# Altium project smart_mcu.PrjPcb
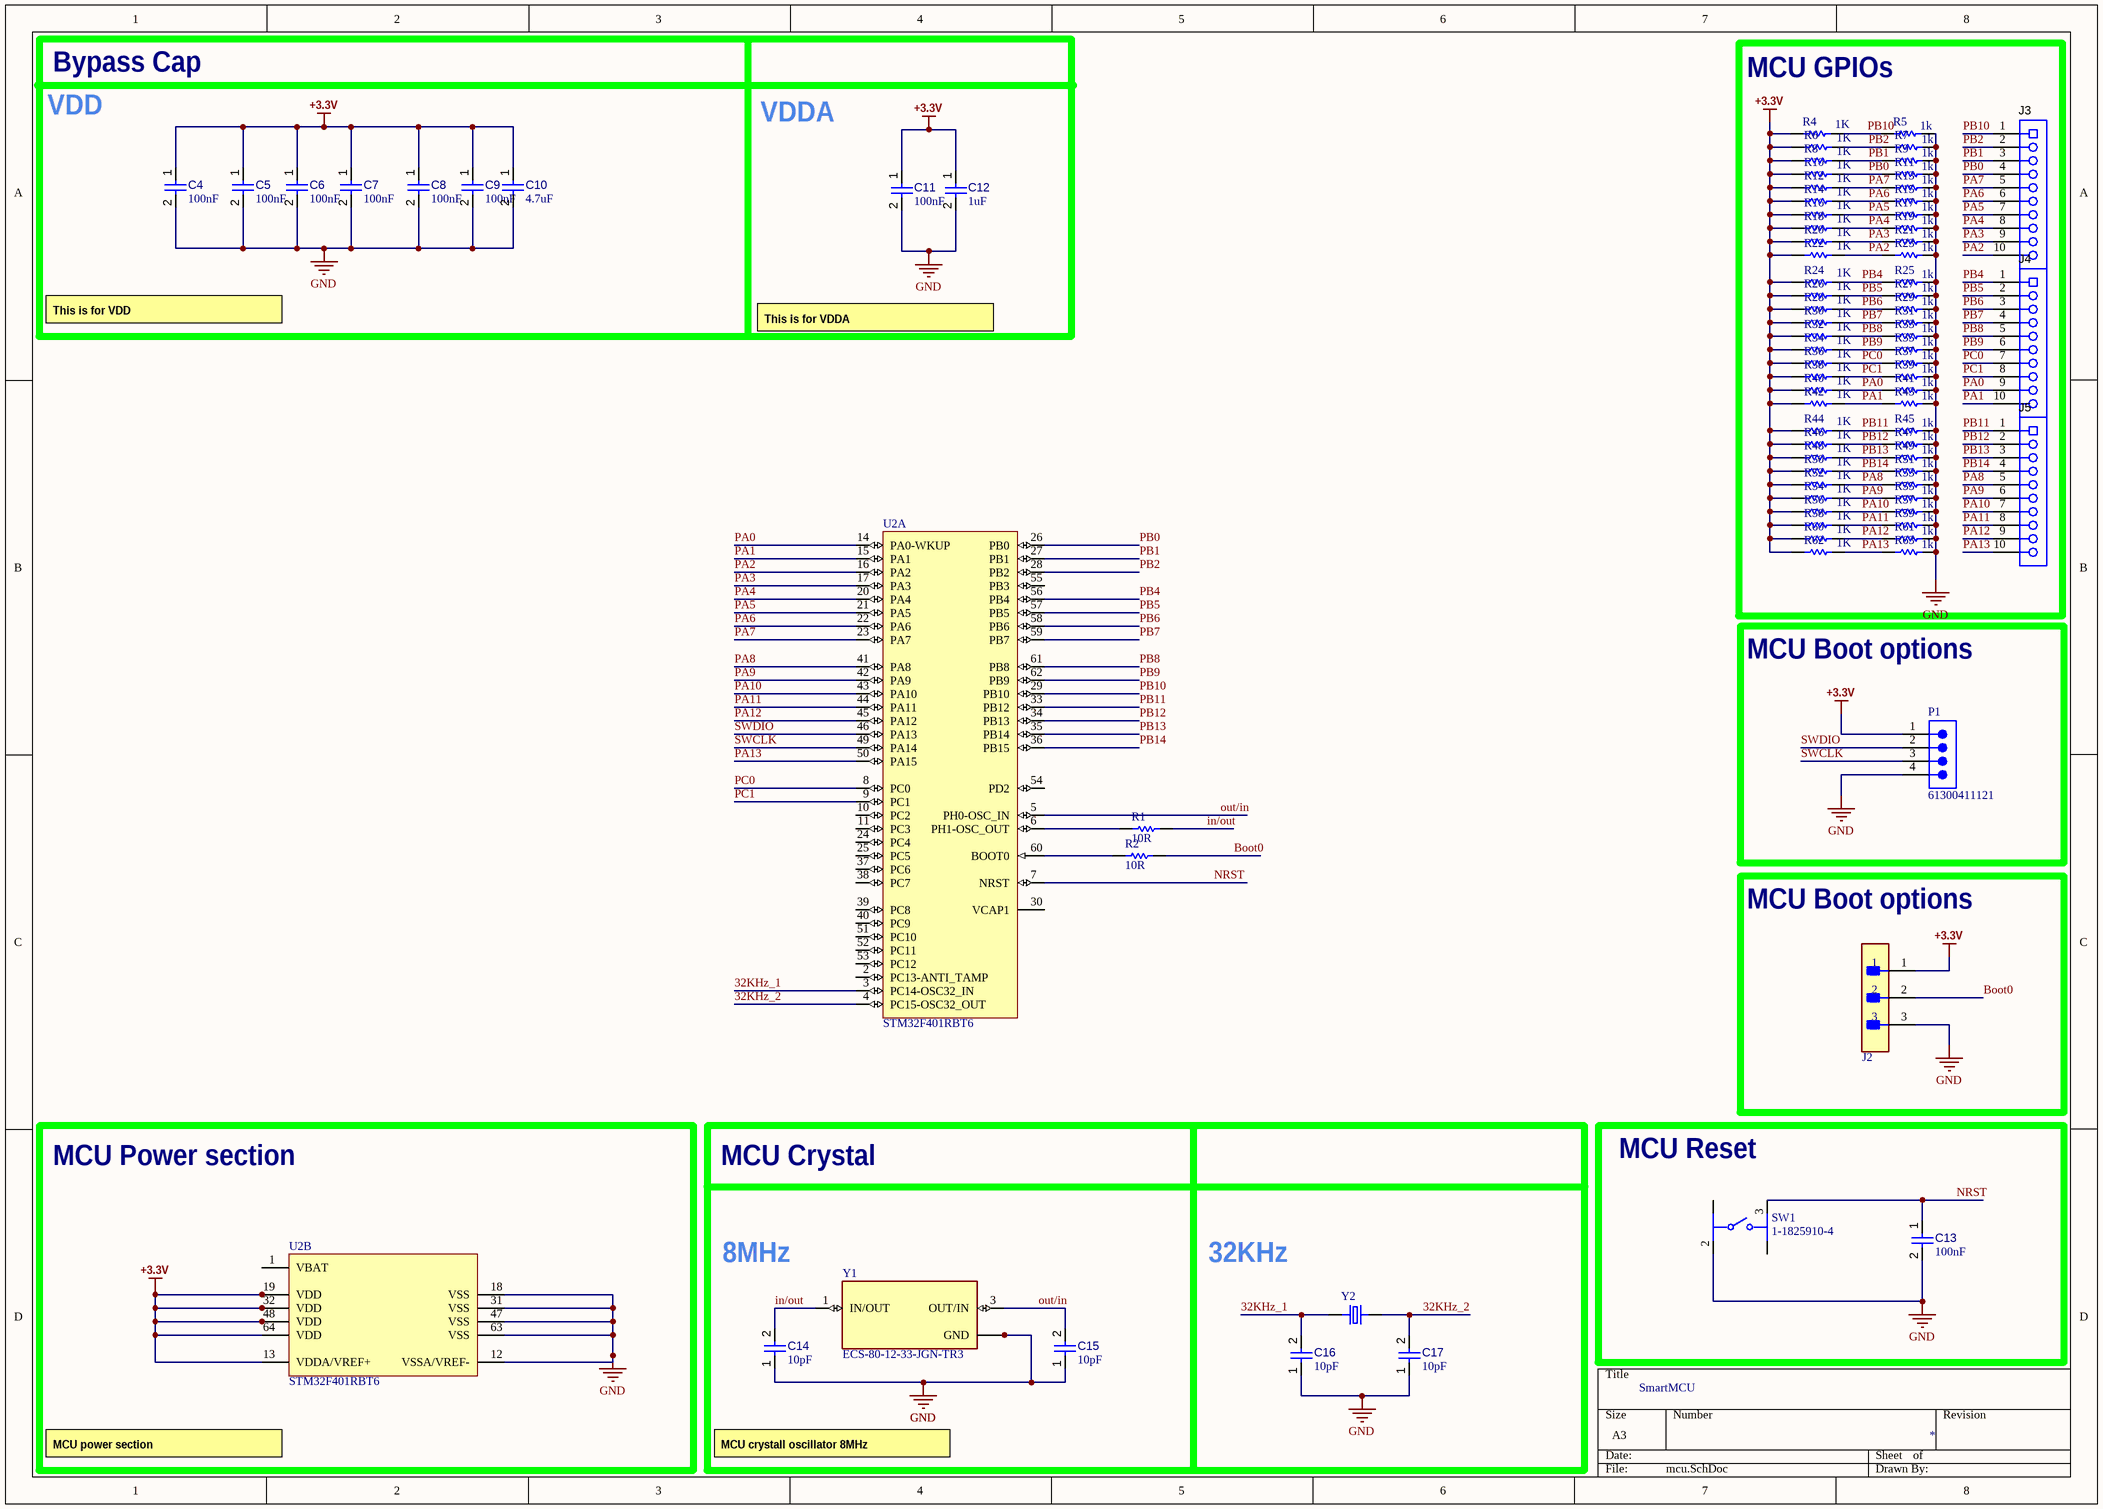
[diagram p0: mcu.SchDoc]
My Title: SmartMCU
3 sheets, 92 parts. Net scope: global (net labels, ports and power ports of the same name join across sheets).
Board file: smartMCUpcb.PcbDoc
Sheets:
  Sheetmain.SchDoc
  mcu.SchDoc
  powersupply.SchDoc

## Sheet Sheetmain.SchDoc
size A3; Author: Antony Austin; SheetNumber: 1; SheetTotal: 3

## Sheet mcu.SchDoc
size A3; SheetNumber: 2; SheetTotal: 3

### Parts
C4  value 100nF  [CAPC0603(1608)100_L]  (hidden comment: Capacitor 4.7µF +/-20% 10V 0603)
C5  value 100nF  [CAPC0603(1608)100_L]  (hidden comment: Capacitor 4.7µF +/-20% 10V 0603)
C6  value 100nF  [CAPC0603(1608)100_L]  (hidden comment: Capacitor 4.7µF +/-20% 10V 0603)
C7  value 100nF  [CAPC0603(1608)100_L]  (hidden comment: Capacitor 4.7µF +/-20% 10V 0603)
C8  value 100nF  [CAPC0603(1608)100_L]  (hidden comment: Capacitor 4.7µF +/-20% 10V 0603)
C9  value 100nF  [CAPC0603(1608)100_L]  (hidden comment: Capacitor 4.7µF +/-20% 10V 0603)
C10  value 4.7uF  [CAPC0603(1608)100_L]  (hidden comment: Capacitor 4.7µF +/-20% 10V 0603)
C11  value 100nF  [CAPC0603(1608)100_L]  (hidden comment: Capacitor 4.7µF +/-20% 10V 0603)
C12  value 1uF  [CAPC0603(1608)100_L]  (hidden comment: Capacitor 4.7µF +/-20% 10V 0603)
C13  value 100nF  [CAPC0603(1608)100_L]  (hidden comment: Capacitor 4.7µF +/-20% 10V 0603)
C14  value 10pF  [CAPC0402(1005)33_L]  (hidden comment: Capacitor 12pF +/-10% 50V 0402)
C15  value 10pF  [CAPC0402(1005)33_L]  (hidden comment: Capacitor 12pF +/-10% 50V 0402)
C16  value 10pF  [CAPC0402(1005)33_L]  (hidden comment: Capacitor 12pF +/-10% 50V 0402)
C17  value 10pF  [CAPC0402(1005)33_L]  (hidden comment: Capacitor 12pF +/-10% 50V 0402)
J2  951103-8622-AR  [FP-951103-8622-AR-MFG]  (value not drawn)
J3  5-534237-8  [TECO-5-534237-8_V]  (value not drawn)
J4  5-534237-8  [TECO-5-534237-8_V]  (value not drawn)
J5  5-534237-8  [TECO-5-534237-8_V]  (value not drawn)
P1  61300411121  [61300411121]
R1  value 10R  [RESC1608X55X25ML10T15]  (hidden comment: Resistor 0R +/- 5% 0603 100 mW)
R2  value 10R  [RESC1608X55X25ML10T15]  (hidden comment: Resistor 0R +/- 5% 0603 100 mW)
R4  value 1K  [RESC1608X55X25ML10T15]  (hidden comment: Resistor 0R +/- 5% 0603 100 mW)
R5  value 1k  [RESC1608X55X25ML10T15]  (hidden comment: Resistor 0R +/- 5% 0603 100 mW)
R6  value 1K  [RESC1608X55X25ML10T15]  (hidden comment: Resistor 0R +/- 5% 0603 100 mW)
R7  value 1k  [RESC1608X55X25ML10T15]  (hidden comment: Resistor 0R +/- 5% 0603 100 mW)
R8  value 1K  [RESC1608X55X25ML10T15]  (hidden comment: Resistor 0R +/- 5% 0603 100 mW)
R9  value 1k  [RESC1608X55X25ML10T15]  (hidden comment: Resistor 0R +/- 5% 0603 100 mW)
R10  value 1K  [RESC1608X55X25ML10T15]  (hidden comment: Resistor 0R +/- 5% 0603 100 mW)
R11  value 1k  [RESC1608X55X25ML10T15]  (hidden comment: Resistor 0R +/- 5% 0603 100 mW)
R12  value 1K  [RESC1608X55X25ML10T15]  (hidden comment: Resistor 0R +/- 5% 0603 100 mW)
R13  value 1k  [RESC1608X55X25ML10T15]  (hidden comment: Resistor 0R +/- 5% 0603 100 mW)
R14  value 1K  [RESC1608X55X25ML10T15]  (hidden comment: Resistor 0R +/- 5% 0603 100 mW)
R15  value 1k  [RESC1608X55X25ML10T15]  (hidden comment: Resistor 0R +/- 5% 0603 100 mW)
R16  value 1K  [RESC1608X55X25ML10T15]  (hidden comment: Resistor 0R +/- 5% 0603 100 mW)
R17  value 1k  [RESC1608X55X25ML10T15]  (hidden comment: Resistor 0R +/- 5% 0603 100 mW)
R18  value 1K  [RESC1608X55X25ML10T15]  (hidden comment: Resistor 0R +/- 5% 0603 100 mW)
R19  value 1k  [RESC1608X55X25ML10T15]  (hidden comment: Resistor 0R +/- 5% 0603 100 mW)
R20  value 1K  [RESC1608X55X25ML10T15]  (hidden comment: Resistor 0R +/- 5% 0603 100 mW)
R21  value 1k  [RESC1608X55X25ML10T15]  (hidden comment: Resistor 0R +/- 5% 0603 100 mW)
R22  value 1K  [RESC1608X55X25ML10T15]  (hidden comment: Resistor 0R +/- 5% 0603 100 mW)
R23  value 1k  [RESC1608X55X25ML10T15]  (hidden comment: Resistor 0R +/- 5% 0603 100 mW)
R24  value 1K  [RESC1608X55X25ML10T15]  (hidden comment: Resistor 0R +/- 5% 0603 100 mW)
R25  value 1k  [RESC1608X55X25ML10T15]  (hidden comment: Resistor 0R +/- 5% 0603 100 mW)
R26  value 1K  [RESC1608X55X25ML10T15]  (hidden comment: Resistor 0R +/- 5% 0603 100 mW)
R27  value 1k  [RESC1608X55X25ML10T15]  (hidden comment: Resistor 0R +/- 5% 0603 100 mW)
R28  value 1K  [RESC1608X55X25ML10T15]  (hidden comment: Resistor 0R +/- 5% 0603 100 mW)
R29  value 1k  [RESC1608X55X25ML10T15]  (hidden comment: Resistor 0R +/- 5% 0603 100 mW)
R30  value 1K  [RESC1608X55X25ML10T15]  (hidden comment: Resistor 0R +/- 5% 0603 100 mW)
R31  value 1k  [RESC1608X55X25ML10T15]  (hidden comment: Resistor 0R +/- 5% 0603 100 mW)
R32  value 1K  [RESC1608X55X25ML10T15]  (hidden comment: Resistor 0R +/- 5% 0603 100 mW)
R33  value 1k  [RESC1608X55X25ML10T15]  (hidden comment: Resistor 0R +/- 5% 0603 100 mW)
R34  value 1K  [RESC1608X55X25ML10T15]  (hidden comment: Resistor 0R +/- 5% 0603 100 mW)
R35  value 1k  [RESC1608X55X25ML10T15]  (hidden comment: Resistor 0R +/- 5% 0603 100 mW)
R36  value 1K  [RESC1608X55X25ML10T15]  (hidden comment: Resistor 0R +/- 5% 0603 100 mW)
R37  value 1k  [RESC1608X55X25ML10T15]  (hidden comment: Resistor 0R +/- 5% 0603 100 mW)
R38  value 1K  [RESC1608X55X25ML10T15]  (hidden comment: Resistor 0R +/- 5% 0603 100 mW)
R39  value 1k  [RESC1608X55X25ML10T15]  (hidden comment: Resistor 0R +/- 5% 0603 100 mW)
R40  value 1K  [RESC1608X55X25ML10T15]  (hidden comment: Resistor 0R +/- 5% 0603 100 mW)
R41  value 1k  [RESC1608X55X25ML10T15]  (hidden comment: Resistor 0R +/- 5% 0603 100 mW)
R42  value 1K  [RESC1608X55X25ML10T15]  (hidden comment: Resistor 0R +/- 5% 0603 100 mW)
R43  value 1k  [RESC1608X55X25ML10T15]  (hidden comment: Resistor 0R +/- 5% 0603 100 mW)
R44  value 1K  [RESC1608X55X25ML10T15]  (hidden comment: Resistor 0R +/- 5% 0603 100 mW)
R45  value 1k  [RESC1608X55X25ML10T15]  (hidden comment: Resistor 0R +/- 5% 0603 100 mW)
R46  value 1K  [RESC1608X55X25ML10T15]  (hidden comment: Resistor 0R +/- 5% 0603 100 mW)
R47  value 1k  [RESC1608X55X25ML10T15]  (hidden comment: Resistor 0R +/- 5% 0603 100 mW)
R48  value 1K  [RESC1608X55X25ML10T15]  (hidden comment: Resistor 0R +/- 5% 0603 100 mW)
R49  value 1k  [RESC1608X55X25ML10T15]  (hidden comment: Resistor 0R +/- 5% 0603 100 mW)
R50  value 1K  [RESC1608X55X25ML10T15]  (hidden comment: Resistor 0R +/- 5% 0603 100 mW)
R51  value 1k  [RESC1608X55X25ML10T15]  (hidden comment: Resistor 0R +/- 5% 0603 100 mW)
R52  value 1K  [RESC1608X55X25ML10T15]  (hidden comment: Resistor 0R +/- 5% 0603 100 mW)
R53  value 1k  [RESC1608X55X25ML10T15]  (hidden comment: Resistor 0R +/- 5% 0603 100 mW)
R54  value 1K  [RESC1608X55X25ML10T15]  (hidden comment: Resistor 0R +/- 5% 0603 100 mW)
R55  value 1k  [RESC1608X55X25ML10T15]  (hidden comment: Resistor 0R +/- 5% 0603 100 mW)
R56  value 1K  [RESC1608X55X25ML10T15]  (hidden comment: Resistor 0R +/- 5% 0603 100 mW)
R57  value 1k  [RESC1608X55X25ML10T15]  (hidden comment: Resistor 0R +/- 5% 0603 100 mW)
R58  value 1K  [RESC1608X55X25ML10T15]  (hidden comment: Resistor 0R +/- 5% 0603 100 mW)
R59  value 1k  [RESC1608X55X25ML10T15]  (hidden comment: Resistor 0R +/- 5% 0603 100 mW)
R60  value 1K  [RESC1608X55X25ML10T15]  (hidden comment: Resistor 0R +/- 5% 0603 100 mW)
R61  value 1k  [RESC1608X55X25ML10T15]  (hidden comment: Resistor 0R +/- 5% 0603 100 mW)
R62  value 1K  [RESC1608X55X25ML10T15]  (hidden comment: Resistor 0R +/- 5% 0603 100 mW)
R63  value 1k  [RESC1608X55X25ML10T15]  (hidden comment: Resistor 0R +/- 5% 0603 100 mW)
SW1  1-1825910-4  [FP-1-1825910-4-MFG]
U2  STM32F401RBT6  [STM-LQFP64_M]  (parts A,B of 2)
Y1  ECS-80-12-33-JGN-TR3  [XTAL_ECS-240-8-33-AGN-TR]
Y2  ECS-.320-12.5-13  [XTAL_ECS-.655-12.5-13X]  (value not drawn)

### Blocks framed on the sheet
MCU GPIOs: J3-J5 R4-R63
MCU Boot options: P1
MCU Boot options: J2
MCU Power section: U2
MCU Reset: C13 SW1

### Nets
+3.3V: C4.1 C5.1 C6.1 C7.1 C8.1 C9.1 C10.1 C11.1 C12.1 J2.1 P1.1 R4.1 R6.1 R8.1 R10.1 R12.1 R14.1 R16.1 R18.1 R20.1 R22.1 R24.1 R26.1 R28.1 R30.1 R32.1 R34.1 R36.1 R38.1 R40.1 R42.1 R44.1 R46.1 R48.1 R50.1 R52.1 R54.1 R56.1 R58.1 R60.1 R62.1 U2.13(VDDA/VREF+) U2.19(VDD) U2.32(VDD) U2.48(VDD) U2.64(VDD)
GND: C4.2 C5.2 C6.2 C7.2 C8.2 C9.2 C10.2 C11.2 C12.2 C13.2 C14.1 C15.1 C16.1 C17.1 J2.3 P1.4 R5.2 R7.2 R9.2 R11.2 R13.2 R15.2 R17.2 R19.2 R21.2 R23.2 R25.2 R27.2 R29.2 R31.2 R33.2 R35.2 R37.2 R39.2 R41.2 R43.2 R45.2 R47.2 R49.2 R51.2 R53.2 R55.2 R57.2 R59.2 R61.2 R63.2 SW1.2 U2.12(VSSA/VREF-) U2.18(VSS) U2.31(VSS) U2.47(VSS) U2.63(VSS) Y1.2(GND) Y1.4(GND)
32KHz_1: C16.2 U2.3(PC14-OSC32_IN) Y2.2
32KHz_2: C17.2 U2.4(PC15-OSC32_OUT) Y2.1
Boot0: J2.2 R2.2
in/out: C14.2 R1.2 Y1.1(IN/OUT)
NRST: C13.1 SW1.3 U2.7(NRST)
out/in: C15.2 U2.5(PH0-OSC_IN) Y1.3(OUT/IN)
PA0: J4.9 R40.2 R41.1 U2.14(PA0-WKUP)
PA1: J4.10 R42.2 R43.1 U2.15(PA1)
PA2: J3.10 R22.2 R23.1 U2.16(PA2)
PA3: J3.9 R20.2 R21.1 U2.17(PA3)
PA4: J3.8 R18.2 R19.1 U2.20(PA4)
PA5: J3.7 R16.2 R17.1 U2.21(PA5)
PA6: J3.6 R14.2 R15.1 U2.22(PA6)
PA7: J3.5 R12.2 R13.1 U2.23(PA7)
PA8: J5.5 R52.2 R53.1 U2.41(PA8)
PA9: J5.6 R54.2 R55.1 U2.42(PA9)
PA10: J5.7 R56.2 R57.1 U2.43(PA10)
PA11: J5.8 R58.2 R59.1 U2.44(PA11)
PA12: J5.9 R60.2 R61.1 U2.45(PA12)
PA13: J5.10 R62.2 R63.1 U2.50(PA15)
PB0: J3.4 R10.2 R11.1 U2.26(PB0)
PB1: J3.3 R8.2 R9.1 U2.27(PB1)
PB2: J3.2 R6.2 R7.1 U2.28(PB2)
PB4: J4.1 R24.2 R25.1 U2.56(PB4)
PB5: J4.2 R26.2 R27.1 U2.57(PB5)
PB6: J4.3 R28.2 R29.1 U2.58(PB6)
PB7: J4.4 R30.2 R31.1 U2.59(PB7)
PB8: J4.5 R32.2 R33.1 U2.61(PB8)
PB9: J4.6 R34.2 R35.1 U2.62(PB9)
PB10: J3.1 R4.2 R5.1 U2.29(PB10)
PB11: J5.1 R44.2 R45.1 U2.33(PB12)
PB12: J5.2 R46.2 R47.1 U2.34(PB13)
PB13: J5.3 R48.2 R49.1 U2.35(PB14)
PB14: J5.4 R50.2 R51.1 U2.36(PB15)
PC0: J4.7 R36.2 R37.1 U2.8(PC0)
PC1: J4.8 R38.2 R39.1 U2.9(PC1)
SWCLK: P1.3 U2.49(PA14)
SWDIO: P1.2 U2.46(PA13)
NetR1_1: R1.1 U2.6(PH1-OSC_OUT)
NetR2_1: R2.1 U2.60(BOOT0)

Not connected (* = marked no-connect by the designer): SW1 1 4; U2 1(VBAT) 2(PC13-ANTI_TAMP) 10(PC2) 11(PC3) 24(PC4) 25(PC5) 30(VCAP1) 37(PC6) 38(PC7) 39(PC8) 40(PC9) 51(PC10) 52(PC11) 53(PC12) 54(PD2) 55(PB3)

### Notes on the sheet
- Bypass Cap
- VDD
- VDDA
- This is for VDD
- This is for VDDA
- MCU Crystal
- 8MHz
- 32KHz
- MCU power section
- MCU crystall oscillator 8MHz

### Library data of the parts
C4-C13 = CMP-001-00076-4: Chip Capacitor, 4.7µF +/-20%, 10V, 0603, Thickness 1 mm; Tolerance: 10%; Mounting Technology: SMT; Case/Package: 0603; Pins: 2; Min Operating Temperature: -55°C; Max Operating Temperature: 85°C; Voltage Rating: 10V
C14-C17 = CMP-001-00072-4: Chip Capacitor, 12pF +/-10%, 50V, 0402, Thickness 0.33 mm; Tolerance: 20%; Pins: 2; Max Operating Temperature: 85°C; Case/Package: 0402; Voltage Rating: 50V; Mounting Technology: SMT; Min Operating Temperature: -55°C
J2 = CMP-05379-000003-1: CONN HEADER VERT 3POS 2MM; Manufacturer: 3M; Conn Gender: Male; Current Rating: 2A; Number Of Contacts: 3; Conn Orientation: Straight; Digikey Description: CONN HEADER VERT 3POS 2MM; Device Class L3: unset; Category: Conn; Height: 6.3mm; Manufacturer Part Number: 951103-8622-AR; RoHS: TRUE; Contact Material: Gold,Nickel; ComponentLink2Description: Datasheet; Temperature Range Low: -55°C; Device Class L1: Connectors; Pitch: 2mm; Mouser Description: Header; PinStrip; CopperAlloy; HighTempThermoplastic; 3Cnts; 1A; RtAngle; 951Series; Octopart: https://octopart.com/951103-8622-ar-3m-14400669; Package: 951103-8622-AR; Lead Free: Yes; Device Class L2: Headers and Wire Housings; Temperature Range High: +125°C; ComponentLink2URL: http://multimedia.3m.com/mws/media/1400506O/3m-pin-strip-header-951-series-78-5100-2653-3.pdf; Automotive: No; Temperature: -55°C to +125°C; Number Of Rows: 1
J3-J5 = CMP-002-00019-2: Female Receptacle, Pitch 2.54 mm, 1 x 10 Position, Height 8.64 mm, Tail Length 2.92 mm, -65 to 105 degC, RoHS, Tube; Manufacturer: TE Connectivity; Max Contact Resistance: 12mohm; Connector Type: Header; Current Rating: 2A; Voltage Rating: 750V; Rows: 1; Datasheet Version: Apr-13; Contact Plating: Gold; Min Operating Temperature: -65°C; Manufacturer URL: http://www.te.com/; Mounting Technology: TH; Contact Material: Bronze; RoHS Compliant: True; Packaging: Rail/Tube; Contact Finish: Gold; Pins: 10; Case/Package: 5-534237-8; Max Operating Temperature: 105°C; Lead Pitch: 2.54mm; Gender: Female; Package Quantity: 22; Colour: Black; Package Description: Female Receptacle, Pitch 2.54 mm, 1 x 10 Position, Height 8.64 mm, Tail Length 2.92 mm; Package Reference: 5-534237-8; Datasheet URL: http://www.te.com/commerce/DocumentDelivery/DDEController?Action=showdoc&DocId=Customer+Drawing%7F534237%7FR5%7Fpdf%7FEnglish%7FENG_CD_534237_R5.pdf%7F5-534237-8
P1 = CMP-1502-01064-3: NexarPartId: 32855522; Operating Supply Voltage: 250V; Pitch: 2.54mm; Contact Resistance: 20mΩ; Number of Positions: 4; Current Rating: 3A; Connector Type: Male Pin; Gender: Male; Contact Plating: Gold; Height: 8.89mm; Lead Pitch: 2.54mm; Lead Free: Lead Free; Contact Mating Length: 5.9944mm; Number of Rows: 1; Termination: Solder; Packaging: Bulk; REACH SVHC: Unknown; Min Operating Temperature: -40°C; RoHS: Compliant; Number of Contacts: 4; Voltage Rating: 250V; Color: Black; Max Operating Temperature: 105°C; Contact Material: Copper; Mount: Through Hole; Orientation: Vertical; Number of Pins: 4
R1 R2 R4-R63 = CMP-009-00006-5: Chip Resistor, 0 Ohm, 0.1 W, -55 to 155 degC, 0603 (1608 Metric); Power: 100mW; Voltage Rating: 50V; Max Operating Temperature: 155°C; RoHS Compliant: True; Mounting Technology: SM; Case/Package: 0603; Min Operating Temperature: -55°C; Tolerance: 5%; Pins: 2
SW1 = CMP-03407-000002-1: SWITCH TACTILE SPST-NO 0.05A 24V; Manufacturer: TE Connectivity; Operating Force: 160gf; Contact Current Rating: 50mA; Electromechanical Life: 100000Cycles; Contact Resistance: 100mΩ; Octopart: https://octopart.com/1-1825910-4-te+connectivity-42270468; ComponentLink2URL: https://www.te.com/commerce/DocumentDelivery/DDEController?Action=showdoc&DocId=Customer+Drawing%7F1825910%7FC10%7Fpdf%7FEnglish%7FENG_CD_1825910_C10.pdf%7F1-1825910-4; Throw Configuration: SPST-NO; Height: 9.8mm; Package: 1-1825910-4; Automotive: No; Device Class L2: Switches; Voltage Rating Dc: 24V; Temperature Range High: +85°C; Device Class L3: Tactile Switches; Mouser Description: Tactile Switches 6MM ACTHIGH TEMP TACT SWITCH; Manufacturer Part Number: 1-1825910-4; Lead Free: Yes; Temperature Range Low: -35°C; Digikey Description: SWITCH TACTILE SPST-NO 0.05A 24V; Device Class L1: Electromechanical; Mount: Through Hole; RoHS: TRUE; ComponentLink2Description: Datasheet; Temperature: -35°C to +85°C; Category: Switch
U2 = CMP-020-00012-3: ARM Cortex -M4 32b MCU+FPU, 256 KB Flash, 64 KB RAM, -40 to 85 degC, 64-Pin LQFP, RoHS, Tray; Manufacturer: STMicroelectronics; Frequency: 84MHz; Interface: USART; Power: 313mW; Max Supply Voltage: 3.6V; RAM Size: 64KB; I/Os: 50; Density: 128KB; Min Supply Voltage: 1.8V; Datasheet URL: http://www.st.com/st-web-ui/static/active/en/resource/technical/document/datasheet/DM00086815.pdf; Package Quantity: 160; Package Description: 64-Pin Low-profile Quad Flat Package, Body 10 x 10 mm, Pitch 0.5 mm; Packaging: Tray; Case/Package: LQFP; Pins: 64; Mounting Technology: SM; RoHS Compliant: True; Datasheet Version: Rev. 5, 08/2015; Manufacturer URL: http://www.st.com/; Package Reference: LQFP64
Y1 = ECS-80-12-33-JGN-TR3: Crystal 8MHz Â±20ppm (Tol) Â±30ppm (Stability) 12pF FUND 400Ohm 4-Pin Mini-CSMD T/R; MF: ECS Inc.; SnapEDA_Link: https://www.snapeda.com/parts/ECS-80-12-33-JGN-TR3/ECS/view-part/?ref=snap; Package: ECX-32-33-4 ECS; Value: *; MP: ECS-80-12-33-JGN-TR3; Check_prices: https://www.snapeda.com/parts/ECS-80-12-33-JGN-TR3/ECS/view-part/?ref=eda
Y2 = ECS-.320-12.5-13: Crystal  Cylindrical Can, Radial; Package: None; Price: None; Availability: Unavailable; MP: ECS-.320-12.5-13; Value: *

## Sheet powersupply.SchDoc
size A3; SheetNumber: 3; SheetTotal: 3
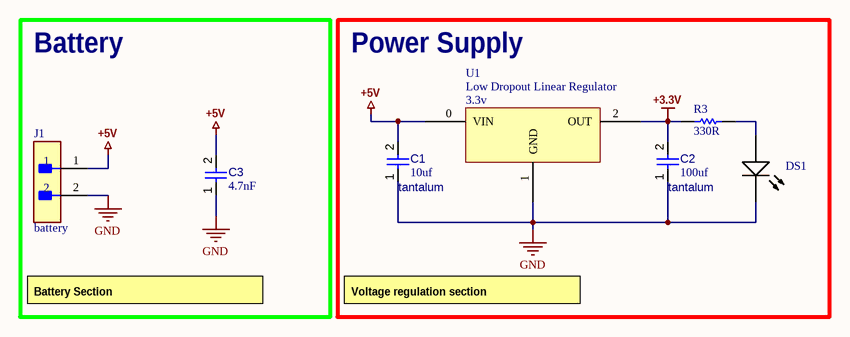
[diagram p1: powersupply.SchDoc]

### Parts
C1  tantalum  value 10uf  [CAPC0603(1608)100_L]
C2  tantalum  value 100uf  [CAPC0603(1608)100_L]
C3  value 4.7nF  [CAPC0603(1608)100_L]  (hidden comment: Capacitor 4.7µF +/-20% 10V 0603)
DS1  16-219A/T2D-AR2T1QY/3T  [EVRL-0402-2_V]  (value not drawn)
J1  battery  [FP-TMM-102-03-T-S-MFG]
R3  value 330R  [RESC1608X55X25ML10T15]  (hidden comment: Resistor 0R +/- 5% 0603 100 mW)
U1  Low Dropout Linear Regulator  Output Volatge: 3.3v  [4 pin SOT]

### Blocks framed on the sheet
Battery: C3 J1
Power Supply: C1 C2 DS1 R3 U1

### Nets
+3.3V: C2.2 R3.1 U1.2(OUT)
+5V: C1.2 C3.2 J1.1 U1.0(VIN)
GND: C1.1 C2.1 C3.1 DS1.2(K) J1.2 U1.1(GND)
NetDS1_1: DS1.1(A) R3.2

### Notes on the sheet
- Battery Section
- Voltage regulation section

### Library data of the parts
C1-C3 = CMP-001-00076-4: as C4 on sheet mcu; Mounting Technology: SMT; Case/Package: 0603; Pins: 2; Min Operating Temperature: -55°C; Max Operating Temperature: 85°C; Voltage Rating: 10V
DS1 = CMP-007-00000-2: Chip LED, White, 5 V, 10 mA, 30 mW, -40 to 85 degC, 2-Pin SMD (0402), RoHS, Tape and Reel; Manufacturer: Everlight Electronics; Luminous Intensity: 360mcd; Forward Voltage: 2.6V; Viewing Angle: 130degrees; Power: 30mW; Forward Current: 5mA; Package Quantity: 3000; Max Operating Temperature: 85°C; Datasheet Version: Rev. 5, 04/2013; Datasheet URL: http://www.everlight.com/file/ProductFile/16-219A-T2D-AR2T1QY-3T.pdf; Package Reference: 0402; Mounting Technology: SM; Case/Package: 0402; Illumination Colour: White; Manufacturer URL: http://www.everlight.com/; Package Description: 2-Pin Surface Mount Device, Body 1 x 0.5 mm; RoHS Compliant: True; Packaging: TapeandReel; Min Operating Temperature: -40°C
J1 = CMP-02766-001621-1: CONN HEADER VERT 2POS 2MM; Max Voltage Rating (AC): 500V; Gender: Male; Number of Positions: 2; Max Current Rating: 3.9A; Series: TMM; Contact Plating: Tin; Depth: 1.97mm; Connector Type: Header; Housing Material: Polymer; Contact Shape: Square; Contact Finish - Mating: TIN; Package Quantity: 1; Length: 4mm; Radiation Hardening: No; RoHS Compliant: Yes; Min Operating Temperature: -55°C; Max Operating Temperature: 105°C; Contact Material: Bronze; Lead Free: Lead Free; Color: Black; Termination: Solder; Number of Rows: 1; Contact Type: Male Pin; Contact Mating Length: 0.157inch; Insulation Material: Polymer; Number of Contacts: 2; Pitch: 2mm; Housing Color: Black; Insulation Color: Black; Orientation: Straight; REACH SVHC: No SVHC; Fastening Type: Pull; Packaging: Bulk; Mount: Through Hole
R3 = CMP-009-00006-5: as R1 on sheet mcu; Max Operating Temperature: 155°C; RoHS Compliant: True; Mounting Technology: SM; Case/Package: 0603; Min Operating Temperature: -55°C; Tolerance: 5%; Pins: 2
U1 = lm1117: ComponentLink1Description: Datasheet; ComponentLink1URL: https://www.ti.com/lit/ds/symlink/lm1117.pdf

## Nets that join several sheets
+3.3V: mcu (46 pins), powersupply (C2.2 R3.1 U1.2)
GND: mcu (54 pins), powersupply (6 pins)